# EAGLE design 002 (EAGLE 9.6.2)

## Sheet 1 of 2
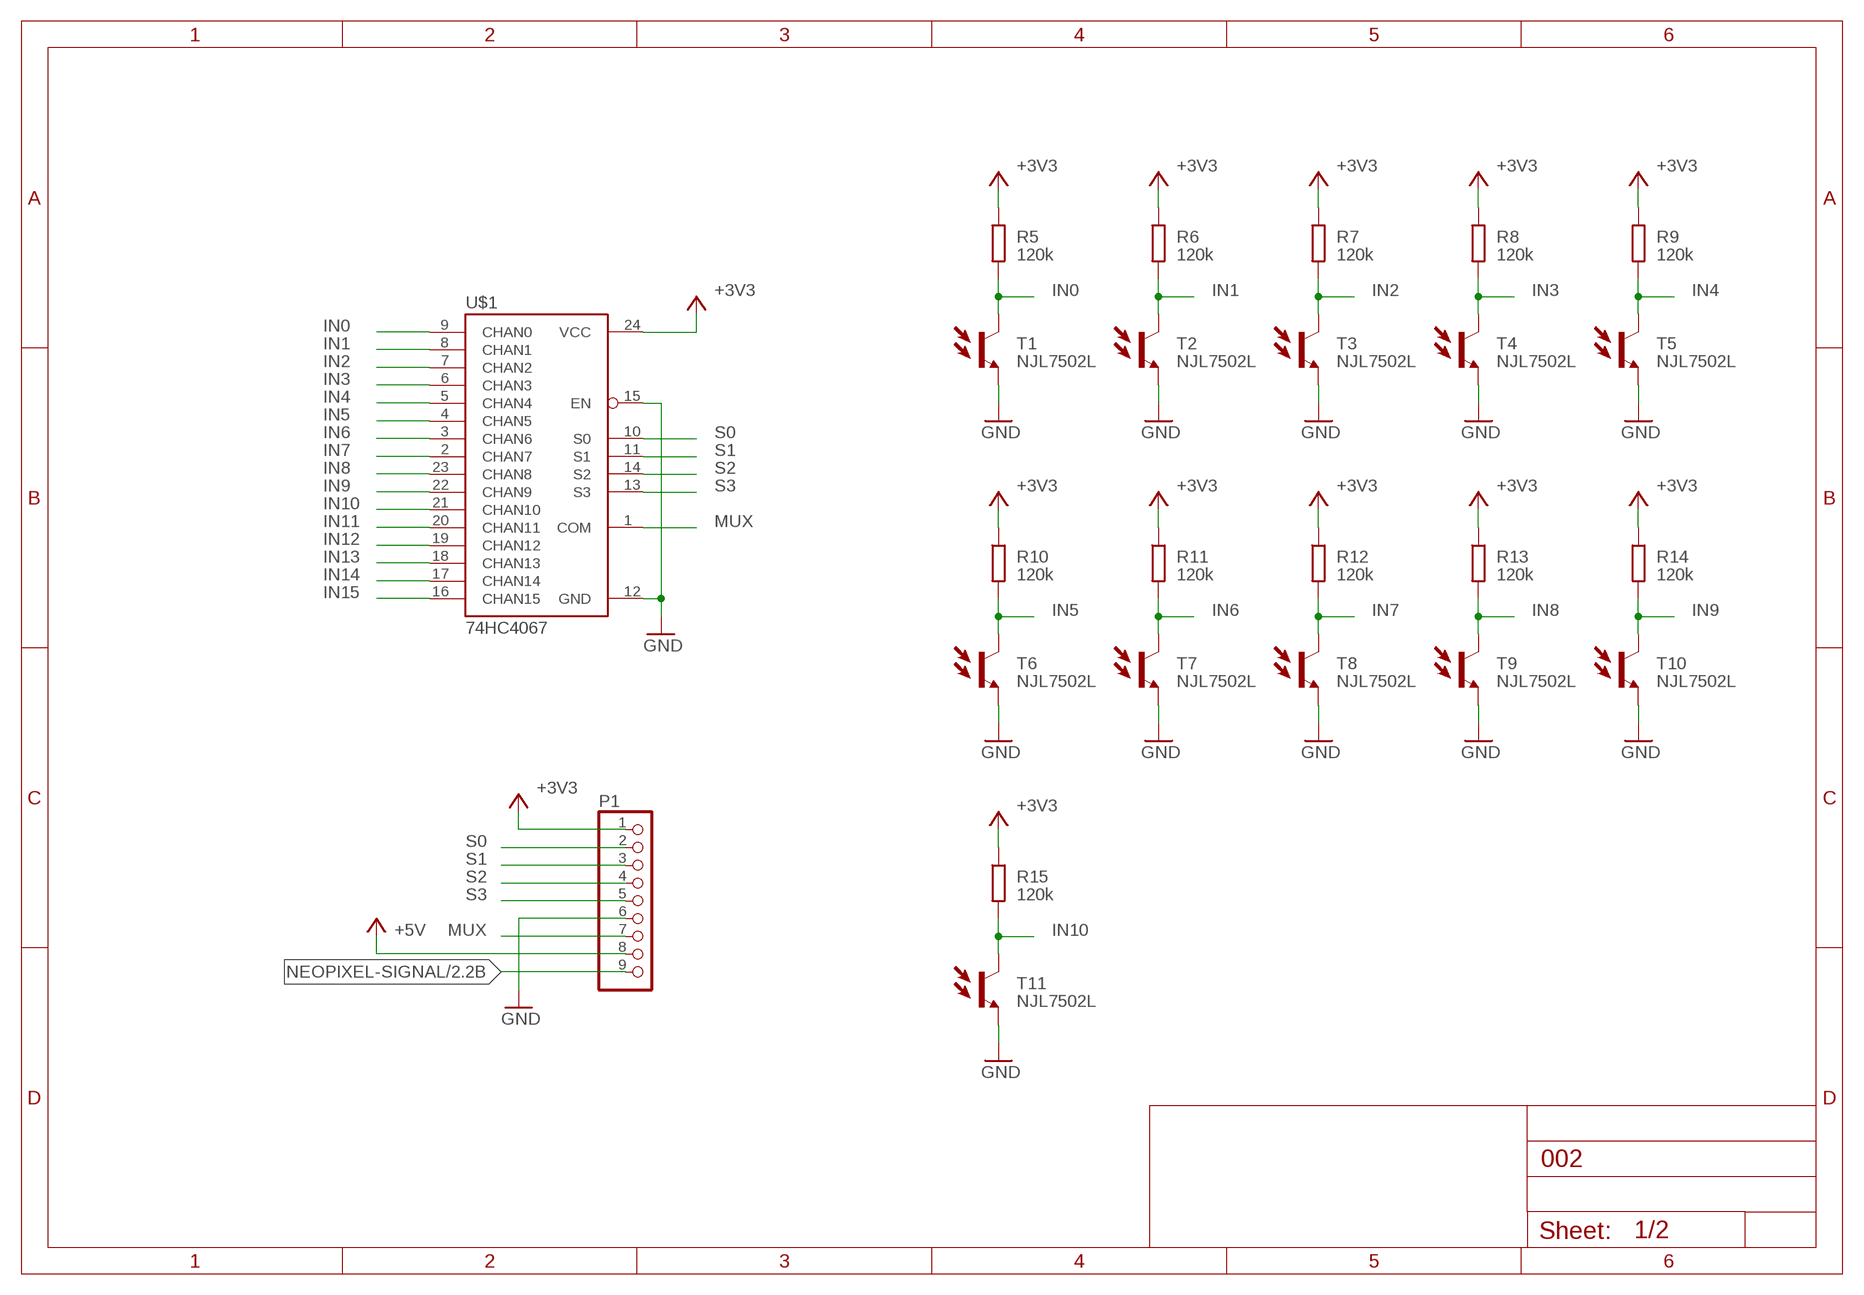
[diagram p0: schematic, sheet 1]

### Parts
P1  S9B-ZR-SM4A-TF  [ZH-SM4-SIDE09]
R5  120k  R-EU_R0805  [R0805]
R6  120k  R-EU_R0805  [R0805]
R7  120k  R-EU_R0805  [R0805]
R8  120k  R-EU_R0805  [R0805]
R9  120k  R-EU_R0805  [R0805]
R10  120k  R-EU_R0805  [R0805]
R11  120k  R-EU_R0805  [R0805]
R12  120k  R-EU_R0805  [R0805]
R13  120k  R-EU_R0805  [R0805]
R14  120k  R-EU_R0805  [R0805]
R15  120k  R-EU_R0805  [R0805]
T1  NJL7502L  MYPARTS_NJL7502L  [MYPARTS_NJL7502L]
T2  NJL7502L  MYPARTS_NJL7502L  [MYPARTS_NJL7502L]
T3  NJL7502L  MYPARTS_NJL7502L  [MYPARTS_NJL7502L]
T4  NJL7502L  MYPARTS_NJL7502L  [MYPARTS_NJL7502L]
T5  NJL7502L  MYPARTS_NJL7502L  [MYPARTS_NJL7502L]
T6  NJL7502L  MYPARTS_NJL7502L  [MYPARTS_NJL7502L]
T7  NJL7502L  MYPARTS_NJL7502L  [MYPARTS_NJL7502L]
T8  NJL7502L  MYPARTS_NJL7502L  [MYPARTS_NJL7502L]
T9  NJL7502L  MYPARTS_NJL7502L  [MYPARTS_NJL7502L]
T10  NJL7502L  MYPARTS_NJL7502L  [MYPARTS_NJL7502L]
T11  NJL7502L  MYPARTS_NJL7502L  [MYPARTS_NJL7502L]
U$1  74HC4067  SPARKFUN_MUX-74HC4067SMD  [SPARKFUN_SSOP24]

### Nets
+3V3: P1.1 R5.1 R6.1 R7.1 R8.1 R9.1 R10.1 R11.1 R12.1 R13.1 R14.1 R15.1 U$1.24(VCC)
+5V: P1.8 ; also sheet 2
GND: P1.6 T1.E T2.E T3.E T4.E T5.E T6.E T7.E T8.E T9.E T10.E T11.E U$1.12(GND) U$1.15(EN) ; also sheet 2
IN0: R5.2 T1.C U$1.9(CHAN0)
IN1: R6.2 T2.C U$1.8(CHAN1)
IN2: R7.2 T3.C U$1.7(CHAN2)
IN3: R8.2 T4.C U$1.6(CHAN3)
IN4: R9.2 T5.C U$1.5(CHAN4)
IN5: R10.2 T6.C U$1.4(CHAN5)
IN6: R11.2 T7.C U$1.3(CHAN6)
IN7: R12.2 T8.C U$1.2(CHAN7)
IN8: R13.2 T9.C U$1.23(CHAN8)
IN9: R14.2 T10.C U$1.22(CHAN9)
IN10: R15.2 T11.C U$1.21(CHAN10)
IN11: U$1.20(CHAN11)
IN12: U$1.19(CHAN12)
IN13: U$1.18(CHAN13)
IN14: U$1.17(CHAN14)
IN15: U$1.16(CHAN15)
MUX: P1.7 U$1.1(COM)
NEOPIXEL-SIGNAL: P1.9 ; also sheet 2
S0: P1.2 U$1.10(S0)
S1: P1.3 U$1.11(S1)
S2: P1.4 U$1.14(S2)
S3: P1.5 U$1.13(S3)

## Sheet 2 of 2: NeoPixels
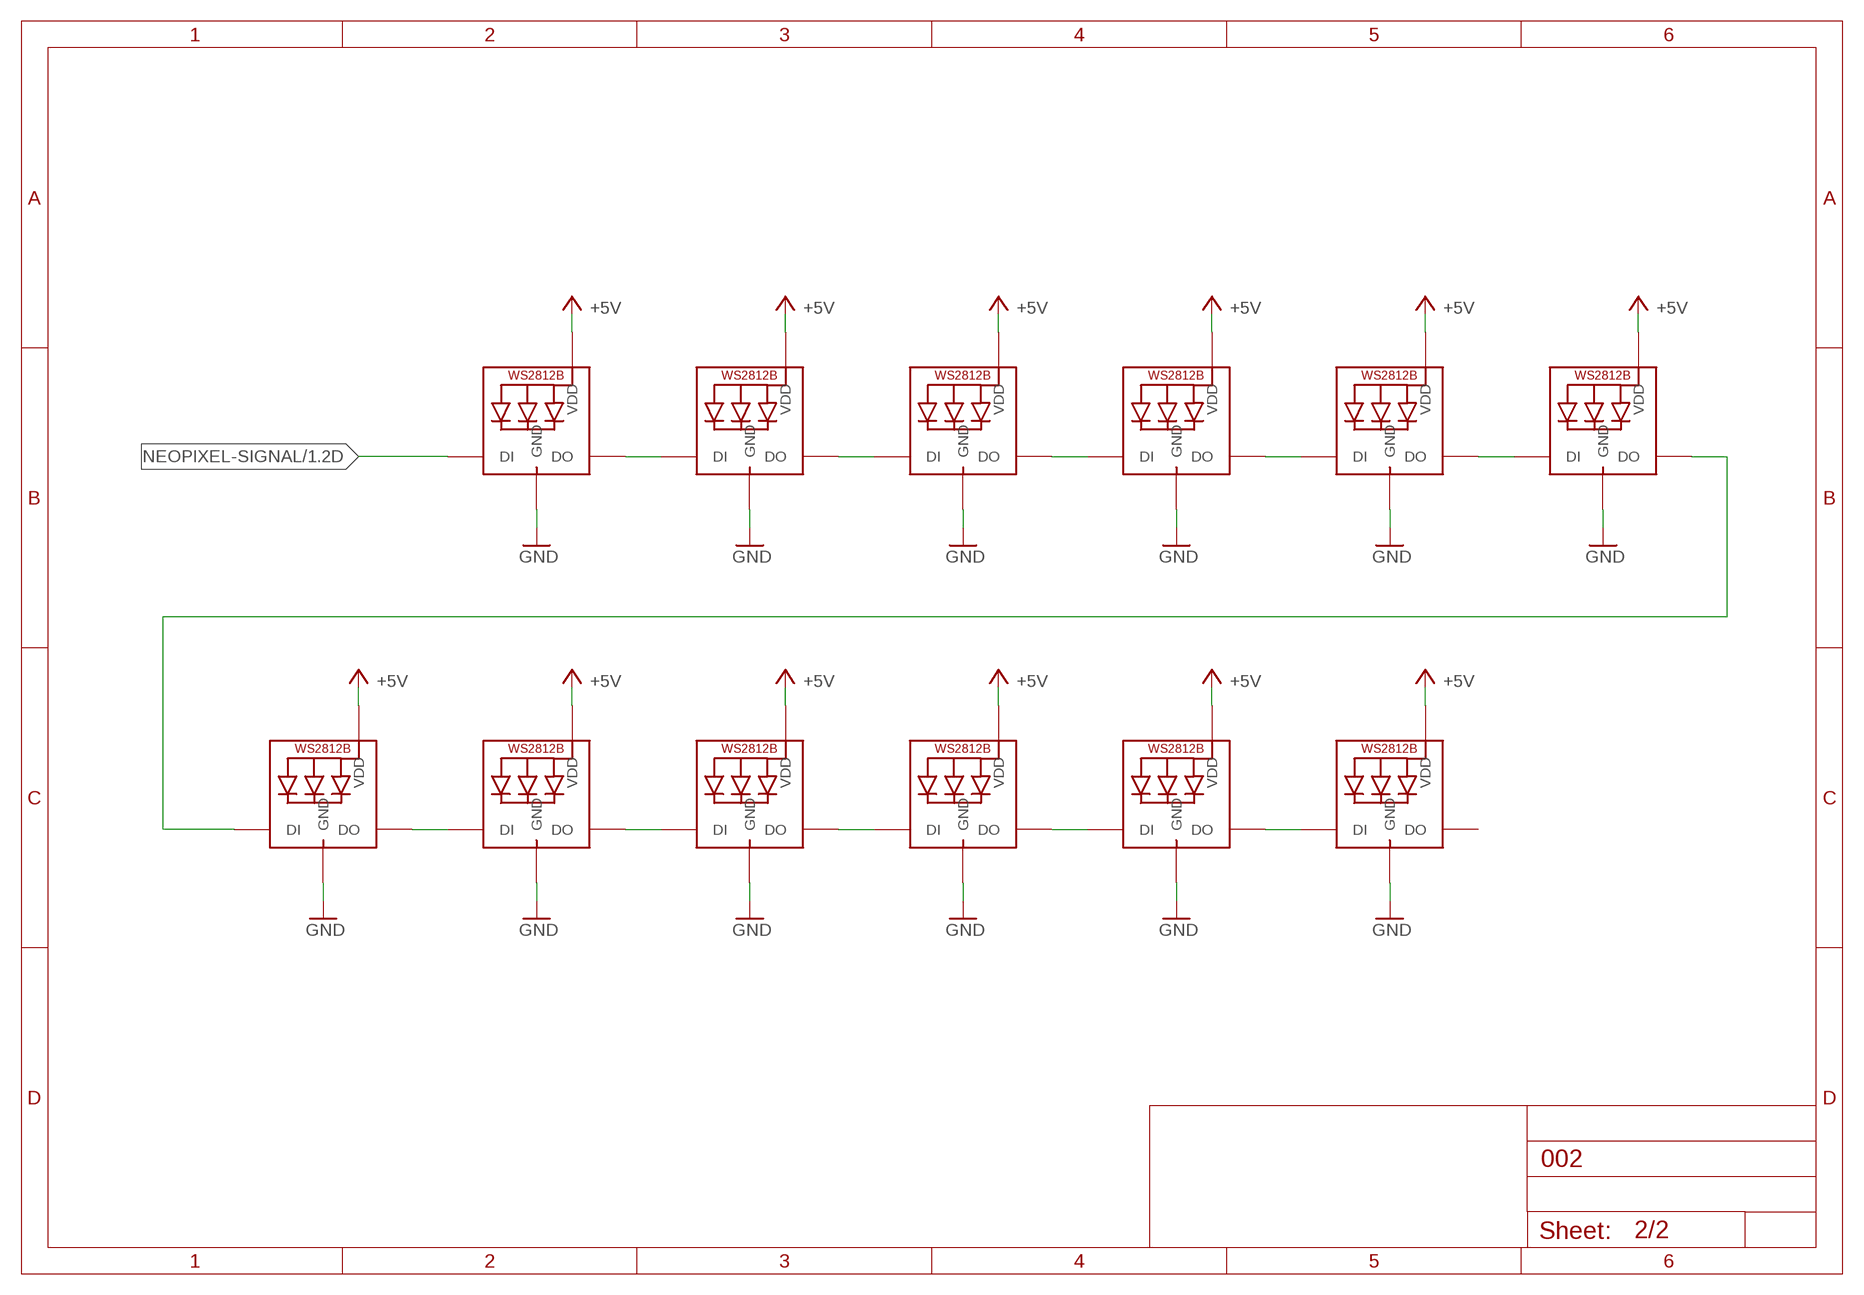
[diagram p1: schematic, sheet 2]

### Parts
LED1  WS2812B5050  [WS2812B]
LED2  WS2812B5050  [WS2812B]
LED3  WS2812B5050  [WS2812B]
LED4  WS2812B5050  [WS2812B]
LED5  WS2812B5050  [WS2812B]
LED6  WS2812B5050  [WS2812B]
LED7  WS2812B5050  [WS2812B]
LED8  WS2812B5050  [WS2812B]
LED9  WS2812B5050  [WS2812B]
LED10  WS2812B5050  [WS2812B]
LED11  WS2812B5050  [WS2812B]
LED12  WS2812B5050  [WS2812B]

### Nets
+5V: LED1.1-VDD(VDD) LED2.1-VDD(VDD) LED3.1-VDD(VDD) LED4.1-VDD(VDD) LED5.1-VDD(VDD) LED6.1-VDD(VDD) LED7.1-VDD(VDD) LED8.1-VDD(VDD) LED9.1-VDD(VDD) LED10.1-VDD(VDD) LED11.1-VDD(VDD) LED12.1-VDD(VDD) ; also sheet 1
GND: LED1.3-GND(GND) LED2.3-GND(GND) LED3.3-GND(GND) LED4.3-GND(GND) LED5.3-GND(GND) LED6.3-GND(GND) LED7.3-GND(GND) LED8.3-GND(GND) LED9.3-GND(GND) LED10.3-GND(GND) LED11.3-GND(GND) LED12.3-GND(GND) ; also sheet 1
N$1: LED2.2-DOUT(DO) LED3.4-DIN(DI)
N$2: LED1.2-DOUT(DO) LED2.4-DIN(DI)
N$3: LED3.2-DOUT(DO) LED4.4-DIN(DI)
N$4: LED4.2-DOUT(DO) LED5.4-DIN(DI)
N$5: LED5.2-DOUT(DO) LED6.4-DIN(DI)
N$6: LED6.2-DOUT(DO) LED7.4-DIN(DI)
N$7: LED7.2-DOUT(DO) LED8.4-DIN(DI)
N$8: LED8.2-DOUT(DO) LED9.4-DIN(DI)
N$9: LED9.2-DOUT(DO) LED10.4-DIN(DI)
N$10: LED10.2-DOUT(DO) LED11.4-DIN(DI)
N$11: LED11.2-DOUT(DO) LED12.4-DIN(DI)
NEOPIXEL-SIGNAL: LED1.4-DIN(DI) ; also sheet 1
Unconnected: LED12.2-DOUT(DO)

## Library data of the parts
LED1-LED12 = microbuilder:WS2812B
P1 = zh:S9B-ZR-SM4A-TF
R5-R15 = rcl:R-EU_: RESISTOR, European symbol; SPICEPREFIX: R
T1-T11 = #001-line:MYPARTS_NJL7502L
U$1 = Analog-Digital-Mux-Breakout:SPARKFUN_MUX-74HC4067

## Net classes
0 default: width 0.178 mm

## Board
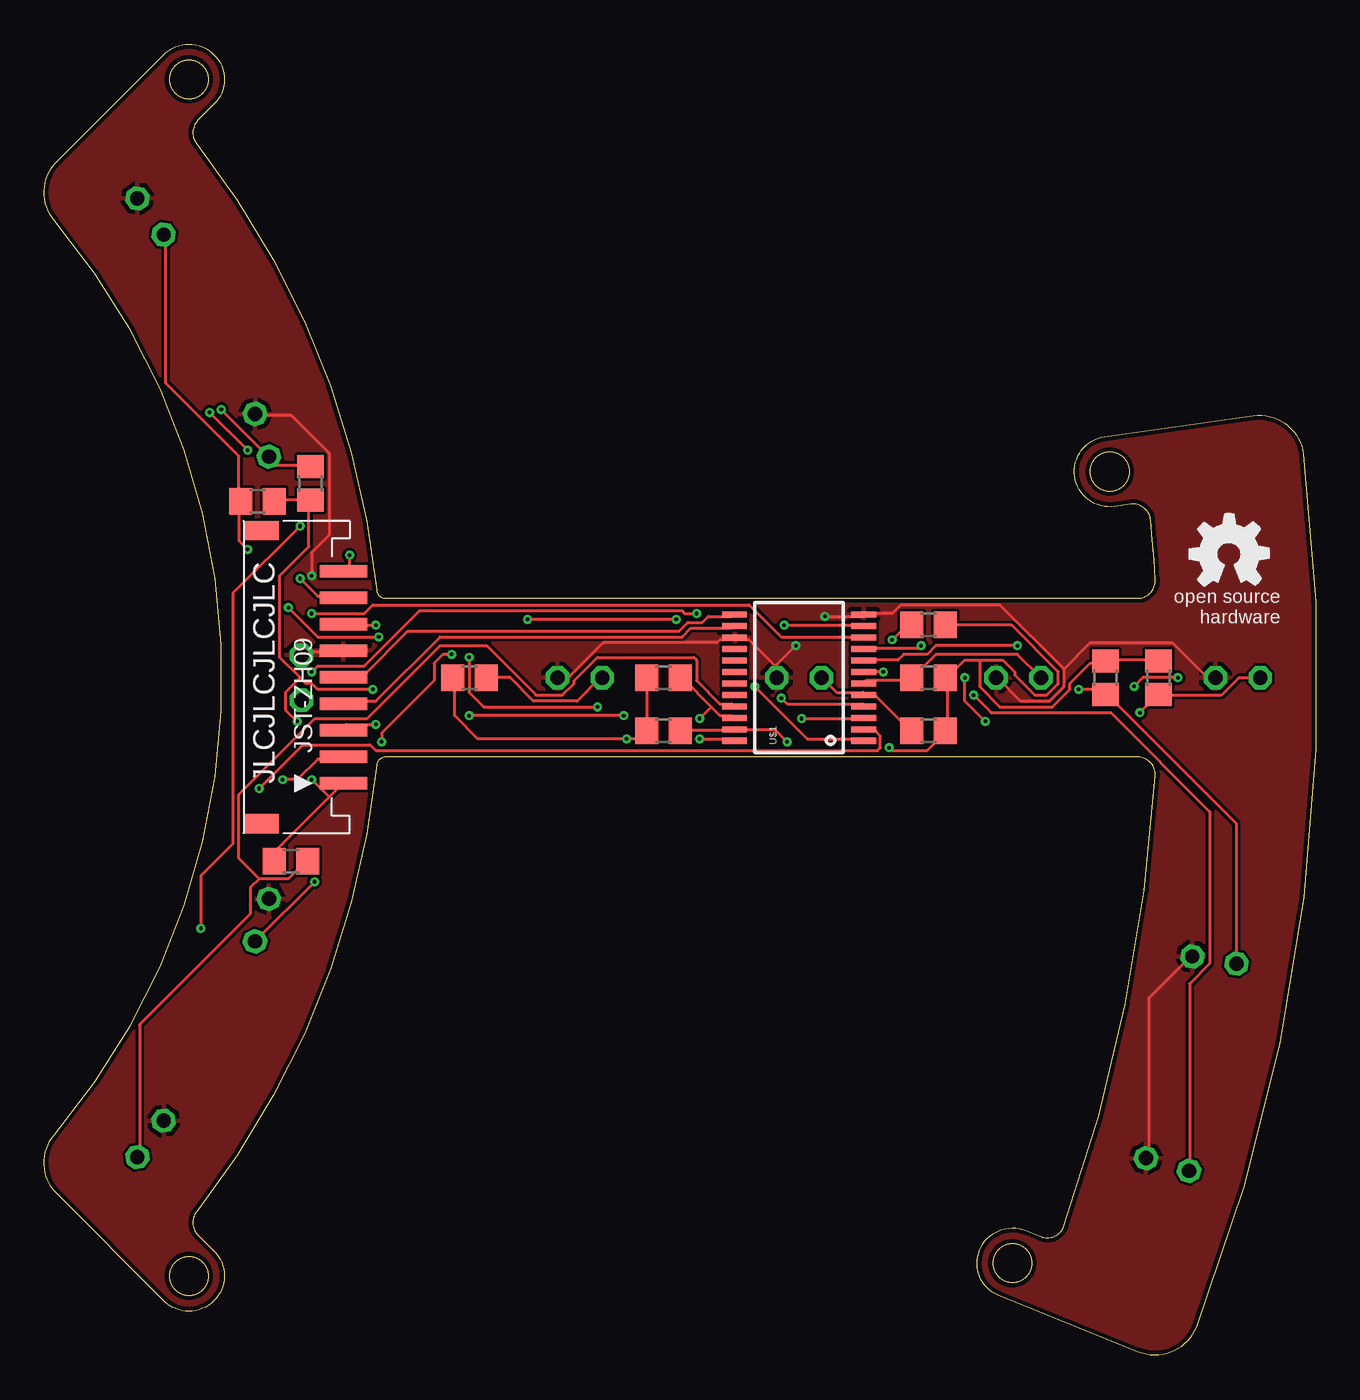
[diagram p2: board, top side]
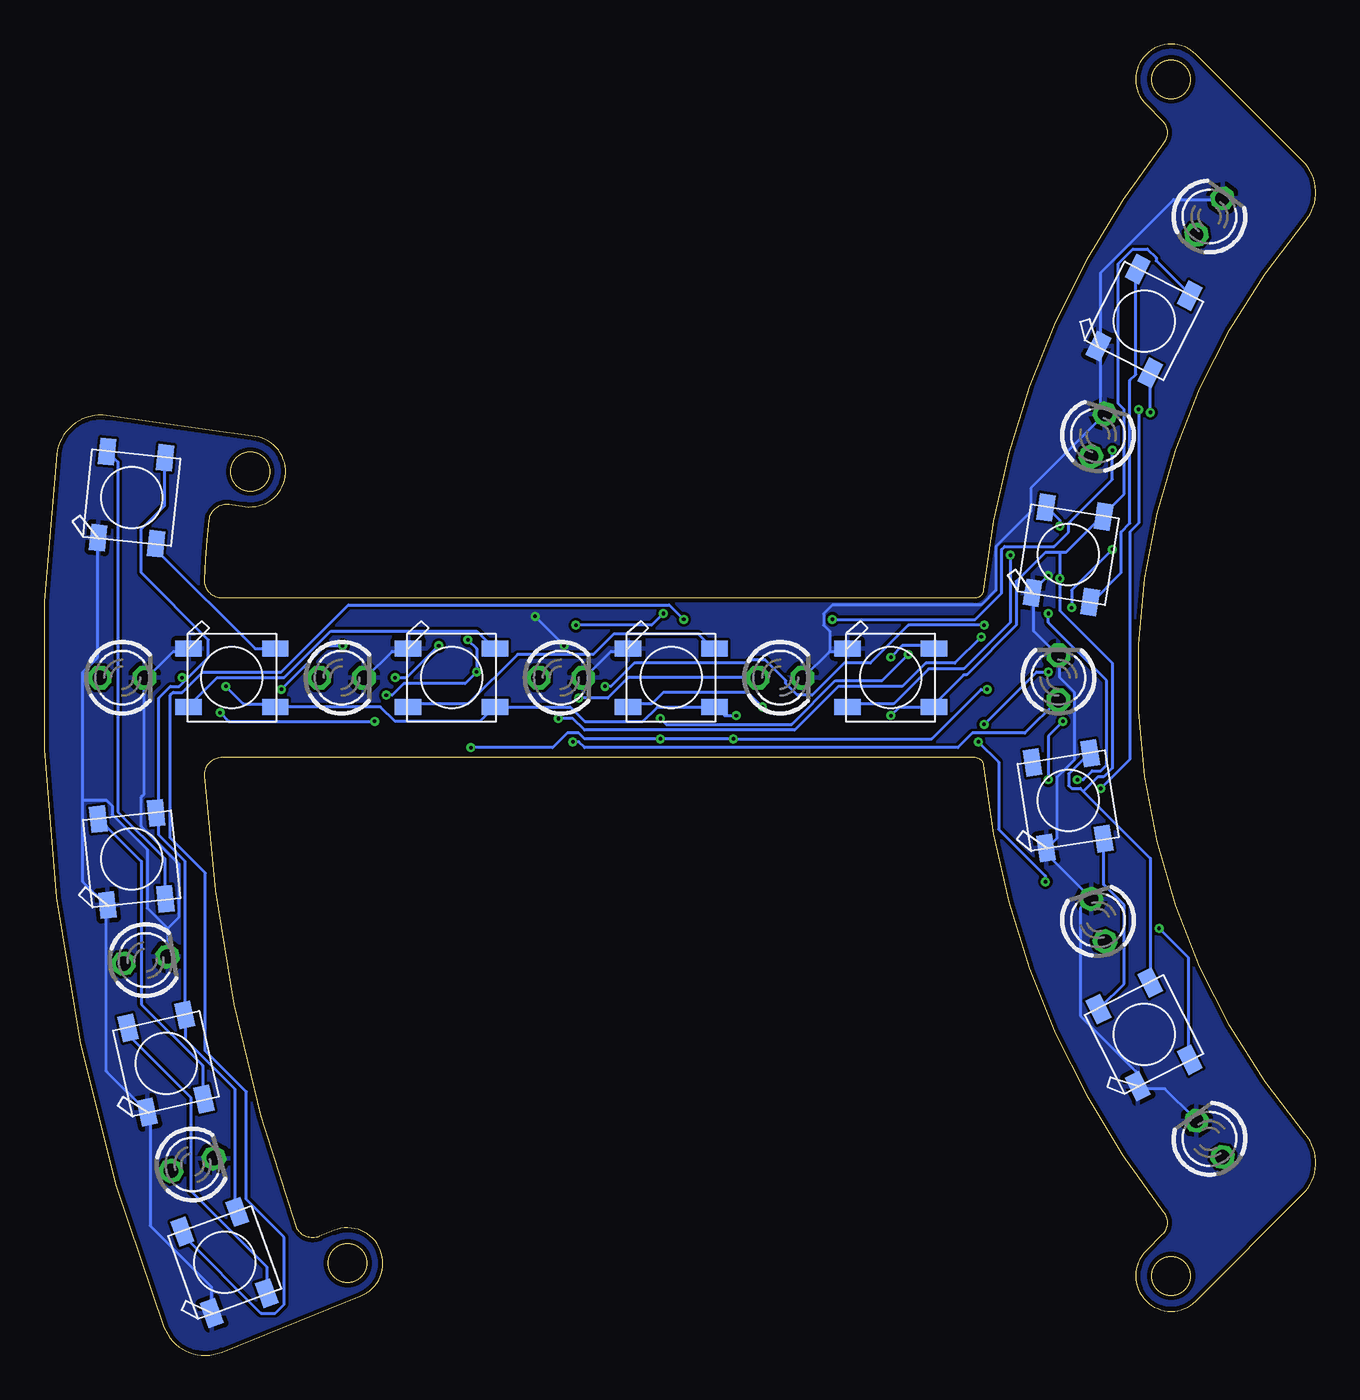
[diagram p3: board, bottom side, seen from below]

Size 71.99 x 74.26 mm. Coordinates in mm from the lower left corner, seen from the top.
Outline: 18.82,33.43 arc-32 8.63,8.14 arc83 8.71,6.81 9.61,5.91 arc-180 6.78,3.09 0.73,9.14 arc-85 0.59,12.52 arc81 0.59,64.24 arc-85 0.73,67.62 6.78,73.67 arc-180 9.61,70.84 8.71,69.94 arc83 8.63,68.62 arc-32 18.82,43.33 arc84 19.32,42.88 61.91,42.88 arc93 62.91,43.94 arc2 62.64,47.31 arc92 61.51,48.2 60.6,48.07 arc-180 60.04,52.03 68.45,53.21 arc-91 71.28,51.05 arc-28 65.21,1.6 arc-91 61.94,0.18 54.07,3.36 arc-180 55.57,7.07 56.42,6.73 arc92 57.73,7.32 arc16 62.91,32.82 arc93 61.91,33.88 19.32,33.88 arc84 18.82,33.43
Outline: circle at 54.82,5.22 radius 1.1
Outline: circle at 8.19,4.5 radius 1.1
Outline: circle at 60.32,50.05 radius 1.1
Outline: circle at 8.19,72.26 radius 1.1
Copper layers (1*16): Top 0.035mm / dielectric 1.5mm / Bottom 0.035mm
Design rules "SeeedStudio_2layer_DRU_no_angle_20140221 *": minimum track width 6mil, minimum drill 8mil, track to track 6mil, track to pad 6mil, pad to pad 6mil, via to via 6mil, smd to smd 0mil, copper to edge 10mil, drill to drill 10mil, minimum pad ring 10mil, minimum via ring 6mil, stop-mask expansion 2mil, vias tented up to drill 100mil, thermal gap 10mil

### Footprints (pad centres in the part's own frame; a part is rotated, then mirrored left to right if it is on the bottom)
WS2812B = smd 1.5 x 0.9: 1-VDD 2.45,-1.65; 2-DOUT 2.45,1.65; 3-GND -2.45,1.65; 4-DIN -2.45,-1.65
ZH-SM4-SIDE09 = smd 0.7 x 2.7: 1 -14.85,-5.65; 2 -13.35,-5.65; 3 -11.85,-5.65; 4 -10.35,-5.65; 5 -8.85,-5.65; 6 -7.35,-5.65; 7 -5.85,-5.65; 8 -4.35,-5.65; 9 -2.85,-5.65 | smd 1.1 x 1.9: P$1 -0.55,-1.05; P$2 -17.15,-1.05
R0805 = smd 1.3 x 1.5: 1 -0.95,0; 2 0.95,0
MYPARTS_NJL7502L = drill 0.813 octagon: C -1.27,0; E 1.27,0
SPARKFUN_SSOP24 = smd 0.348 x 1.397: 1 -3.575,-3.656; 2 -2.925,-3.656; 3 -2.275,-3.656; 4 -1.625,-3.656; 5 -0.975,-3.656; 6 -0.325,-3.656; 7 0.325,-3.656; 8 0.975,-3.656; 9 1.625,-3.656; 10 2.275,-3.656; 11 2.925,-3.656; 12 3.575,-3.656; 13 3.575,3.656; 14 2.925,3.656; 15 2.275,3.656; 16 1.625,3.656; 17 0.975,3.656; 18 0.325,3.656; 19 -0.325,3.656; 20 -0.975,3.656; 21 -1.625,3.656; 22 -2.275,3.656; 23 -2.925,3.656; 24 -3.575,3.656

### Placement (x,y rotation side)
LED1  24.07,38.38 0 bottom
LED2  36.5,38.38 0 bottom
LED3  48.93,38.38 0 bottom
LED4  61.36,38.38 0 bottom
LED5  67.04,48.57 84 bottom
LED6  67.03,28.11 96.1 bottom
LED7  65.09,16.53 102.9 bottom
LED8  61.78,5.26 109.9 bottom
LED9  9.72,58.58 63 bottom
LED10  14.03,45.34 81 bottom
LED11  9.72,18.18 117 bottom
LED12  14.03,31.42 99 bottom
P1  11.29,47.26 90 top
R5  63.07,38.38 270 top
R6  60.07,38.38 270 top
R7  50.07,41.38 180 top
R8  50.07,38.38 180 top
R9  50.07,35.38 180 top
R10  24.07,38.38 0 top
R11  12.07,48.38 180 top
R12  15.07,49.38 90 top
R13  35.07,35.38 0 top
R14  35.07,38.38 0 top
R15  13.97,27.98 0 top
T1  67.57,38.38 0 bottom
T2  66.25,22.38 9.4 bottom
T3  63.59,10.81 16.4 bottom
T4  55.16,38.38 0 bottom
T5  42.74,38.38 0 bottom
T6  30.32,38.38 0 bottom
T7  6.02,64.5 54 bottom
T8  12.33,52.11 72 bottom
T9  14.57,38.38 90 bottom
T10  12.33,24.65 108 bottom
T11  6.02,12.26 126 bottom
U$1  42.74,38.38 90 top
U$2  [OSHW_5MM]  67.07,45.38 0 top

### Tracks (layer width: path | path; a pad name or v marks a point on that pad's centre or on a via)
+3V3  (via drill 0.2)
  Top 0.178: R5.1 63.02,39.37 60.22,39.37 R6.1 60.05,39.2 59.23,39.2 58.07,38.05 58.07,37.72 57.08,36.73 54.11,36.73 52.95,37.88 52.95,39.37 | 51.14,38.38 51.14,35.41 R9.1 50.97,35.24 49.98,34.25 48,34.25 v47.84,34.42 | 52.95,39.37 52.13,39.37 51.14,38.38 | 52.95,39.37 54.27,39.37 54.93,38.71 54.93,38.54 56.09,37.39 56.75,37.39 57.41,38.05 57.41,38.71 54.77,41.35 51.14,41.35 R7.1 | 51.14,38.38 R8.1 | 16.14,31.61 16.8,32.27 P1.1 | 16.14,31.61 13.16,28.64 13.16,28.14 R15.1 | R11.1 13.16,48.45 14.98,48.45 R12.1 14.98,48.28 14.98,45.81 13.33,44.16 13.33,39.53 14.49,38.38 | v37.1,34.91 38.92,34.91 U$1.24 | R10.1 23.24,38.38 23.24,36.23 24.56,34.91 v32.98,34.91 33.64,34.91 33.97,35.24 R13.1 34.13,35.41 R14.1 | 14.49,38.38 14.82,38.05 15.15,38.05 15.48,37.72 v18.61,37.72 | v15.15,32.6 16.14,31.61 | v14.32,35.9 13.66,36.56 13.66,37.55 14.49,38.38
  Bottom 0.178: v18.61,37.72 18.94,37.72 21.75,34.91 v32.98,34.91 v37.1,34.91 41.4,34.91 41.73,35.24 42.39,35.24 43.21,34.42 v47.84,34.42 | v15.15,32.6 15.15,35.08 v14.32,35.9
+5V  (via drill 0.2)
  Top 0.178: v14.49,43.99 15.48,43 16.8,43 P1.8 | v61.7,37.88 62.2,38.38 v64.18,38.38 | v32.81,36.23 v24.06,36.23
  Bottom 0.178: 13.16,31.94 13.33,32.1 13.83,32.1 13.99,32.27 13.99,32.93 12.83,34.09 LED12.1-VDD | 13.16,31.94 9.37,28.14 9.37,21.21 LED11.1-VDD | 14.49,45.48 14.16,45.48 12.17,47.46 LED10.1-VDD 12.01,47.62 10.85,48.78 10.85,53.57 11.18,53.9 11.18,61.82 10.36,62.65 9.53,62.65 9.04,62.15 9.04,61.99 7.22,60.17 LED9.1-VDD | 14.49,45.48 15.31,45.48 16.96,43.83 16.96,41.35 19.77,38.54 19.93,38.54 21.58,36.89 LED1.1-VDD 21.75,36.73 23.57,36.73 v24.06,36.23 | 14.49,45.48 v14.49,43.99 14.49,42.18 11.51,39.2 11.51,33.26 12.01,32.77 12.34,32.77 13.16,31.94 | LED8.1-VDD 61.21,8.17 61.21,15.1 64.02,17.91 64.02,19.23 LED7.1-VDD 64.02,19.39 64.02,27.98 65.5,29.46 65.5,30.62 LED6.1-VDD 65.5,30.78 65.5,37.22 64.84,37.88 64.35,37.88 64.02,38.21 | 64.02,38.21 62.69,39.53 62.69,40.52 66.49,44.32 66.49,46.8 65.17,48.12 65.17,50.76 LED5.1-VDD | v61.7,37.88 60.71,36.89 59.06,36.89 LED4.1-VDD 58.9,36.73 52.95,36.73 52.13,35.9 47.34,35.9 46.51,36.73 LED3.1-VDD 46.35,36.73 42.22,36.73 41.4,35.9 38.09,35.9 37.27,36.73 34.13,36.73 LED2.1-VDD 33.97,36.73 33.47,36.23 v32.81,36.23 | 64.02,38.21 v64.18,38.38
GND  (via drill 0.2)
  Top 0.178: 57.74,38.87 54.11,42.51 48.5,42.51 48,42.01 46.51,42.01 U$1.12 46.35,41.85 v44.2,41.85 | 57.74,38.87 57.74,37.88 56.92,37.06 55.27,37.06 53.94,38.38 T4.E | T1.E 65.83,38.38 63.85,40.36 59.23,40.36 57.74,38.87 | T3.E 62.53,11.3 62.53,20.22 64.84,22.53 T2.E | P1.6 16.8,39.86 14.82,39.86 14.65,39.7 T9.E | 41.4,39.04 39.91,40.52 39.09,40.52 U$1.15 38.92,40.52 38.26,40.52 38.09,40.36 31.66,40.36 29.67,38.38 T6.E | 41.4,39.04 41.4,38.38 T5.E | v15.15,44.16 15.15,45.48 16.14,46.47 16.14,51.09 13.99,53.24 12.01,53.24 T8.E | 41.4,39.04 v42.55,40.19
  Bottom 0.178: LED4.3-GND 63.85,39.86 64.68,39.86 66.16,38.38 T1.E 66.33,38.38 66.33,31.77 66.49,31.61 66.49,29.96 64.35,27.81 64.35,24.84 65.01,24.18 | LED3.3-GND 51.47,39.86 52.29,39.86 53.78,38.38 T4.E | LED8.3-GND 62.53,2.55 62.53,3.87 66,7.34 66,13.61 LED7.3-GND 68.47,16.09 68.47,25.34 LED6.3-GND 68.47,25.5 69.79,26.82 69.79,31.44 | 69.79,31.44 69.79,38.71 68.97,39.53 68.97,46.3 LED5.3-GND | 65.01,24.18 65.01,22.69 T2.E | 65.01,24.18 66.16,25.34 66.16,28.64 68.14,30.62 68.14,31.11 68.47,31.44 69.79,31.44 | T11.E 6.89,13.45 8.54,15.1 10.03,15.1 LED11.3-GND 10.19,15.26 10.19,16.09 13.33,19.23 13.33,25.34 12.83,25.83 T10.E 12.83,26 15.15,28.31 15.15,28.64 LED12.3-GND 15.15,28.8 14.65,29.3 14.65,32.77 13.66,33.76 13.66,37.55 14.49,38.38 14.49,39.53 T9.E 14.65,39.7 15.97,41.02 15.97,43.17 LED10.3-GND 15.97,43.33 v15.15,44.16 | 27.53,39.86 26.54,39.86 LED1.3-GND | 27.53,39.86 29.01,38.38 T6.E | LED2.3-GND 39.09,39.86 39.91,39.86 41.4,38.38 T5.E | T7.E 5.4,65.45 8.05,65.45 12.17,61.33 12.17,57.2 LED9.3-GND 12.17,57.03 12.17,53.57 12.01,53.4 T8.E 12.01,53.24 16.14,49.11 16.14,47.79 18.12,45.81 18.12,43.33 18.94,42.51 27.36,42.51 27.86,42.01 27.86,41.35 27.53,41.02 27.53,39.86 | v42.55,40.19 v44.2,41.85
  pour Top: -0.93,75.38 -0.93,-0.62 73.07,-0.62 73.07,75.38
  pour Bottom: -0.93,75.38 -0.93,-0.62 73.07,-0.62 73.07,75.38
IN0  (via drill 0.2)
  Top 0.178: v49.65,40.19 49.49,40.03 46.51,40.03 U$1.9 | v52.13,38.38 52.13,37.06 v53.28,35.9 | v62.03,36.4 63.02,37.39 R5.2 63.19,37.39 66.66,37.39 67.65,38.38 T1.C
  Bottom 0.178: v49.65,40.19 51.47,38.38 v52.13,38.38 | v53.28,35.9 61.54,35.9 v62.03,36.4
IN1  (via drill 0.2)
  Top 0.178: v55.1,40.19 50.48,40.19 49.98,39.7 48.66,39.7 48.33,39.37 46.51,39.37 U$1.8 | v58.57,37.72 59.89,37.72 60.05,37.55 R6.2 60.22,37.39 67.48,30.12 67.48,22.2 T2.C
  Bottom 0.178: v55.1,40.19 56.09,40.19 v58.57,37.72
IN2  (via drill 0.2)
  Top 0.178: v47.51,38.71 46.51,38.71 U$1.7 | v48,40.52 48.99,41.52 R7.2 | v52.62,37.39 53.61,36.4 60.38,36.4 66,30.78 66,22.2 64.84,21.04 64.84,10.48 T3.C
  Bottom 0.178: v48,40.52 47.51,40.03 v47.51,38.71 48.17,38.05 51.63,38.05 52.29,37.39 v52.62,37.39
IN3
  Top 0.178: U$1.6 46.51,38.21 48.83,38.21 48.99,38.38 R8.2 49.16,38.38 50.48,39.7 55.1,39.7 T4.C
IN4
  Top 0.178: T5.C 44.04,38.38 44.86,37.55 46.35,37.55 U$1.5 46.51,37.39 47.01,37.39 48.99,35.41 R9.2
IN5  (via drill 0.2)
  Top 0.178: v41.73,37.22 42.06,36.89 46.35,36.89 U$1.4 | R10.2 26.37,38.38 27.69,37.06 30.17,37.06 31.49,38.38 T6.C
  Bottom 0.178: v41.73,37.22 40.08,37.22 38.92,38.38 T6.C
IN6  (via drill 0.2)
  Top 0.178: v42.88,36.07 46.35,36.07 U$1.3 | v18.94,40.69 15.48,40.69 v13.83,42.34 | v11.51,45.64 11.02,46.14 11.02,48.28 R11.2 11.02,48.45 11.02,50.93 6.89,55.05 6.89,63.31 T7.C
  Bottom 0.178: v42.88,36.07 42.06,36.07 41.4,35.41 29.51,35.41 27.03,37.88 23.4,37.88 22.08,39.2 20.43,39.2 v18.94,40.69 | v13.83,42.34 13.83,43.33 v11.51,45.64
IN7  (via drill 0.2)
  Top 0.178: v12.17,32.1 14.65,34.58 18.45,34.58 18.78,34.25 47.18,34.25 47.34,34.42 47.34,35.08 47.01,35.41 46.51,35.41 U$1.2 | v10.03,53.57 12.67,50.93 T8.C 12.83,50.76 13.16,50.43 14.98,50.43 R12.2
  Bottom 0.178: v12.17,32.1 10.52,33.76 10.52,46.63 10.03,47.13 v10.03,53.57
IN8  (via drill 0.2)
  Top 0.178: R13.2 36.11,35.41 38.92,35.41 U$1.23 39.09,35.41 41.4,35.41 v42.06,34.75
  Bottom 0.178: v42.06,34.75 41.73,34.75 41.4,34.42 20.26,34.42 19.44,35.24 16.47,35.24 14.65,37.06 T9.C
IN9  (via drill 0.2)
  Top 0.178: 37.76,36.73 36.11,38.38 R14.2 | 37.76,36.73 38.26,36.23 38.92,36.23 U$1.22 | v15.31,26.82 12.01,23.52 T10.C | v19.11,34.75 19.11,35.24 22.08,38.21 22.08,39.2 22.58,39.7 v23.07,39.7 | 37.76,36.73 v37.1,36.07
  Bottom 0.178: v15.31,26.82 15.31,27.15 17.95,29.79 17.95,33.59 v19.11,34.75 | v23.07,39.7 24.56,38.21 27.2,38.21 29.67,35.74 36.77,35.74 v37.1,36.07
IN10
  Top 0.178: 12.17,26.99 11.02,28.14 11.02,31.77 15.31,36.07 18.28,36.07 22.41,40.19 25.05,40.19 27.86,37.39 29.34,37.39 30,38.05 30,38.21 31.33,39.53 36.77,39.53 36.94,39.37 36.94,38.21 38.26,36.89 38.92,36.89 U$1.21 | 12.17,26.99 13.83,26.99 14.82,27.98 R15.2 | 12.17,26.99 11.68,26.49 11.68,25.01 5.4,18.73 5.4,11.3 T11.C
MUX  (via drill 0.2)
  Top 0.178: v40.24,37.88 43.21,34.91 46.35,34.91 U$1.1 | v18.78,41.35 16.96,41.35 P1.7
  Bottom 0.178: v40.24,37.88 39.91,37.88 38.59,39.2 32.15,39.2 31.99,39.37 31.16,39.37 30,38.21 30,38.05 29.34,37.39 28.52,37.39 26.7,39.2 25.22,39.2 23.07,41.35 v18.78,41.35
N$1
  Bottom 0.178: LED3.4-DIN 51.3,36.89 48,36.89 45.19,39.7 40.9,39.7 39.75,40.86 34.96,40.86 34.13,40.03 LED2.2-DOUT
N$2  (via drill 0.2)
  Top 0.178: v31.33,36.73 24.89,36.73 24.06,37.55 v24.06,39.53
  Bottom 0.178: v31.33,36.73 32.15,37.55 36.94,37.55 37.6,36.89 38.92,36.89 LED2.4-DIN | v24.06,39.53 23.4,40.19 21.91,40.19 21.75,40.03 LED1.2-DOUT
N$3
  Bottom 0.178: LED3.2-DOUT 46.51,40.03 47.51,41.02 55.76,41.02 58.4,38.38 62.2,38.38 63.69,36.89 LED4.4-DIN
N$4
  Bottom 0.178: LED4.2-DOUT 59.06,40.03 60.05,40.03 65.5,45.48 65.5,45.81 LED5.4-DIN
N$5
  Bottom 0.178: LED6.4-DIN 65.17,26 65.17,28.14 67.81,30.78 67.81,50.6 68.31,51.09 LED5.2-DOUT
N$6
  Bottom 0.178: LED7.4-DIN 63.02,14.6 63.02,16.42 66.49,19.89 66.49,27.98 68.8,30.29 LED6.2-DOUT
N$7
  Bottom 0.178: LED8.4-DIN 59.39,3.54 59.39,5.03 63.69,9.32 63.69,14.6 67.15,18.07 67.15,18.4 LED7.2-DOUT
N$8  (via drill 0.2)
  Top 0.178: v11.51,51.26 v9.37,53.4 | v35.78,41.68 v27.36,41.68
  Bottom 0.178: v9.37,53.4 9.37,55.55 LED9.4-DIN | v11.51,51.26 11.51,49.61 13.99,47.13 13.99,46.63 14.82,45.81 17.62,45.81 17.79,45.64 17.79,43.17 19.27,41.68 v27.36,41.68 | v35.78,41.68 36.61,42.51 54.77,42.51 58.57,38.71 63.02,38.71 64.18,37.55 64.68,37.55 64.84,37.39 64.84,29.3 62.86,27.32 62.86,17.25 60.55,14.93 60.55,8.83 58.4,6.68 58.4,2.88 58.9,2.39 59.72,2.39 64.18,6.84 LED8.2-DOUT
N$9
  Bottom 0.178: LED9.2-DOUT 10.19,61.49 10.19,55.55 10.52,55.22 10.52,47.13 11.02,46.63 11.02,44.32 12.67,42.67 LED10.4-DIN
N$10  (via drill 0.2)
  Top 0.178: v8.87,24.18 8.87,27.15 10.69,28.97 10.69,43.17 v14.49,46.96
  Bottom 0.178: v8.87,24.18 7.22,22.53 7.22,16.75 LED11.4-DIN | v14.49,46.96 14.49,47.29 15.15,47.95 LED10.2-DOUT
N$11
  Bottom 0.178: LED12.4-DIN 12.01,29.13 12.01,26.66 10.85,25.5 10.85,21.04 12.17,19.72 LED11.2-DOUT
NEOPIXEL-SIGNAL  (via drill 0.2)
  Top 0.178: v17.29,45.31 17.29,44.82 16.96,44.49 P1.9
  Bottom 0.178: v17.29,45.31 17.29,41.52 19.93,38.87 21.91,38.87 23.9,36.89 26.37,36.89 LED1.4-DIN
S0  (via drill 0.2)
  Top 0.178: v15.15,42.01 18.12,42.01 18.61,42.51 39.91,42.51 41.73,40.69 46.35,40.69 U$1.10 | v13.49,32.6 14.32,32.6 15.48,33.76 16.8,33.76 P1.2
  Bottom 0.178: v15.15,42.01 15.15,41.52 11.84,38.21 11.84,33.43 12.17,33.1 12.67,33.1 13.16,32.6 v13.49,32.6
S1  (via drill 0.2)
  Top 0.178: v41.89,41.35 46.35,41.35 U$1.11 | v36.94,42.01 36.28,42.01 36.11,42.18 21.25,42.18 18.12,39.04 15.48,39.04 v15.15,38.71 | v18.78,35.74 17.13,35.74 16.96,35.57 P1.3
  Bottom 0.178: v41.89,41.35 37.6,41.35 v36.94,42.01 | v15.15,38.71 15.81,38.71 v18.78,35.74
S2
  Top 0.178: U$1.14 38.92,41.19 36.61,41.19 36.11,40.69 22.41,40.69 18.78,37.06 16.96,37.06 P1.4
S3
  Top 0.178: U$1.13 38.92,41.85 37.6,41.85 37.27,41.52 36.44,41.52 35.95,41.02 20.59,41.02 18.12,38.54 16.96,38.54 P1.5

### Text on the board
tPlace: JLCJLCJLCJLC